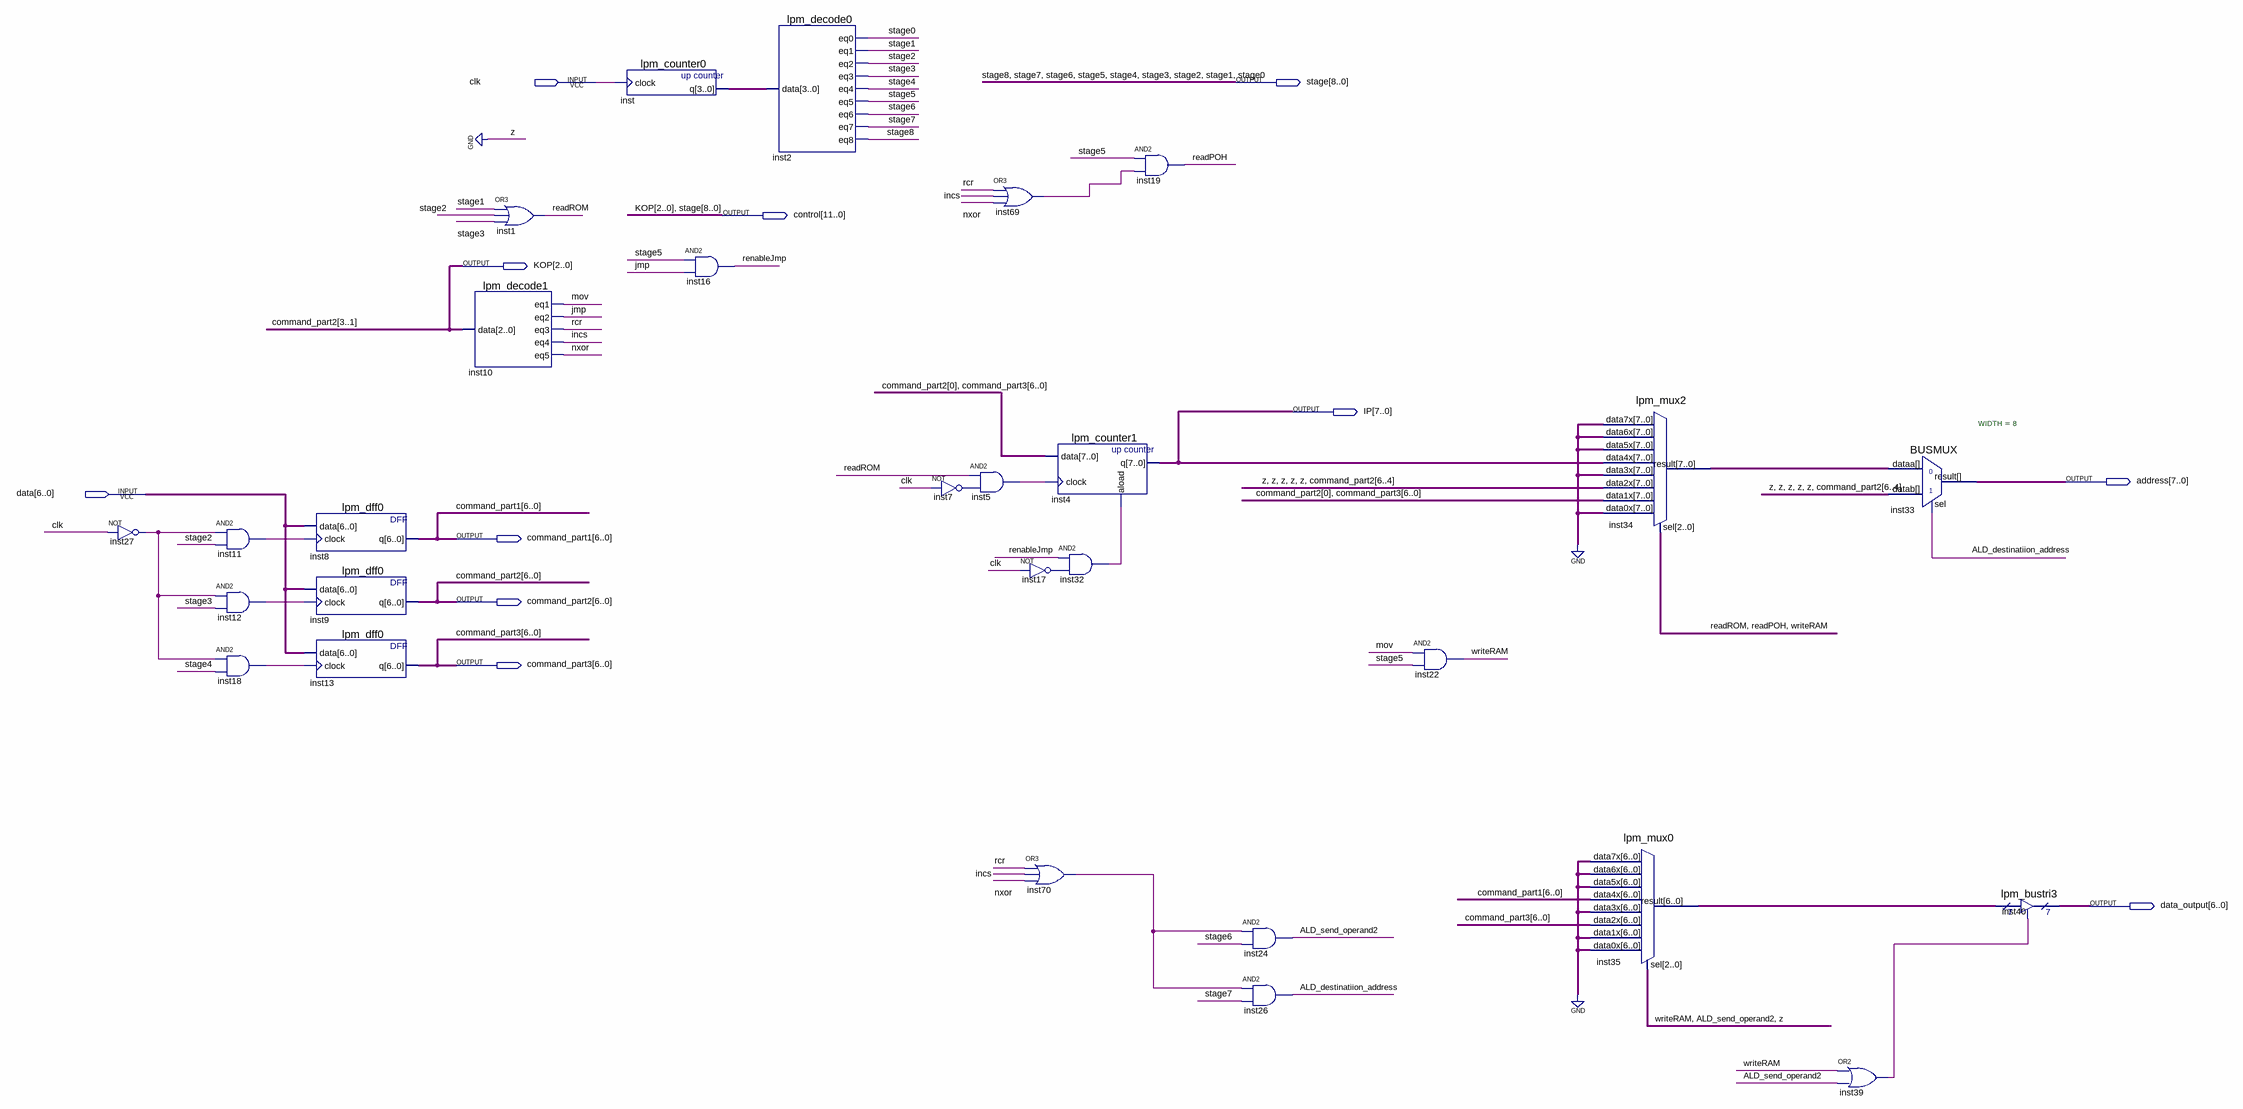
[diagram p0: schematic sheet]
// Quartus schematic DC.bdf as structural Verilog: 28 symbols, 11 pins
module DC (
  input  clk,
  input  [6:0] data,
  output [8:0] stage,
  output [11:0] control,
  output [2:0] KOP,
  output [7:0] IP,
  output [7:0] address,
  output [6:0] command_part1,
  output [6:0] command_part2,
  output [6:0] command_part3,
  output [6:0] data_output
);

  wire ALD_destinatiion_address, ALD_send_operand2, incs, inst5_out, inst7_out, inst11_out, inst12_out,
       inst17_out, inst18_out, inst27_out, inst32_out, inst39_out, inst69_out, inst70_out, jmp, mov, nxor,
       rcr, readPOH, readROM, renableJmp, writeRAM;
  wire [3:0] inst_q;
  wire [6:0] inst35_result;
  wire [7:0] inst34_result;

  not inst27 (inst27_out, clk);
  and inst11 (inst11_out, inst27_out, control[2]);
  and inst12 (inst12_out, inst27_out, control[3]);
  and inst18 (inst18_out, inst27_out, control[4]);
  lpm_dff0 inst8 (.data(data), .clock(inst11_out), .q(command_part1));
  lpm_dff0 inst9 (.data(data), .clock(inst12_out), .q(command_part2));
  lpm_dff0 inst13 (.data(data), .clock(inst18_out), .q(command_part3));
  lpm_decode1 inst10 (.data(command_part2[3:1]), .eq1(mov), .eq2(jmp), .eq3(rcr), .eq4(incs), .eq5(nxor));
  or inst1 (readROM, control[1], control[2], control[3]);
  lpm_counter0 inst (.clock(clk), .q(inst_q));
  and inst16 (renableJmp, control[5], jmp);
  lpm_decode0 inst2 (
    .data(inst_q), .eq0(control[0]), .eq1(control[1]), .eq2(control[2]), .eq3(control[3]), .eq4(control[4]),
    .eq5(control[5]), .eq6(control[6]), .eq7(control[7]), .eq8(control[8]));
  not inst7 (inst7_out, clk);
  or inst69 (inst69_out, rcr, incs, nxor);
  and inst5 (inst5_out, readROM, inst7_out);
  lpm_counter1 inst4 (.data({command_part2[0], command_part3}), .clock(inst5_out), .aload(inst32_out), .q(IP));
  not inst17 (inst17_out, clk);
  or inst70 (inst70_out, rcr, incs, nxor);
  and inst32 (inst32_out, renableJmp, inst17_out);
  and inst19 (readPOH, control[5], inst69_out);
  and inst24 (ALD_send_operand2, inst70_out, control[6]);
  and inst26 (ALD_destinatiion_address, inst70_out, control[7]);
  and inst22 (writeRAM, mov, control[5]);
  lpm_mux2 inst34 (
    .data7x({8{1'b0}}), .data6x({8{1'b0}}), .data5x({8{1'b0}}), .data4x(IP), .data3x({8{1'b0}}),
    .data2x({{5{1'b0}}, command_part2[6:4]}), .data1x({command_part2[0], command_part3}), .data0x({8{1'b0}}),
    .sel({readROM, readPOH, writeRAM}), .result(inst34_result));
  lpm_mux0 inst35 (
    .data7x({7{1'b0}}), .data6x({7{1'b0}}), .data5x({7{1'b0}}), .data4x(command_part1), .data3x({7{1'b0}}),
    .data2x(command_part3), .data1x({7{1'b0}}), .data0x({7{1'b0}}),
    .sel({writeRAM, ALD_send_operand2, 1'b0}), .result(inst35_result));
  or inst39 (inst39_out, writeRAM, ALD_send_operand2);
  BUSMUX #(.WIDTH(8)) inst33 (
    .datab({{5{1'b0}}, command_part2[6:4]}), .sel(ALD_destinatiion_address), .dataa(inst34_result),
    .result(address));
  lpm_bustri3 inst40 (.enabledt(inst39_out), .data(inst35_result), .tridata(data_output));

  assign control[11:9] = command_part2[3:1];
  assign KOP = command_part2[3:1];
  assign stage = control[8:0];

  // Other names for the same wires on the sheet: stage0 = control[0]; stage1 = control[1]; stage2 = control[2];
  //   stage3 = control[3]; stage4 = control[4]; stage5 = control[5]; stage6 = control[6]; stage7 = control[7];
  //   stage8 = control[8]
endmodule
